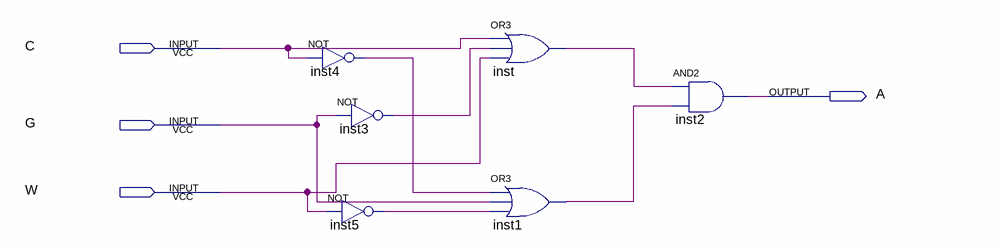
[diagram p0: schematic sheet]
// Quartus schematic lab3step0.bdf as structural Verilog: 6 symbols, 4 pins
module lab3step0 (
  input  C,
  input  G,
  input  W,
  output A
);

  wire inst1_out, inst3_out, inst4_out, inst5_out, inst_out;

  not inst4 (inst4_out, C);
  not inst3 (inst3_out, G);
  not inst5 (inst5_out, W);
  or inst (inst_out, C, inst3_out, W);
  or inst1 (inst1_out, inst4_out, G, inst5_out);
  and inst2 (A, inst_out, inst1_out);
endmodule
